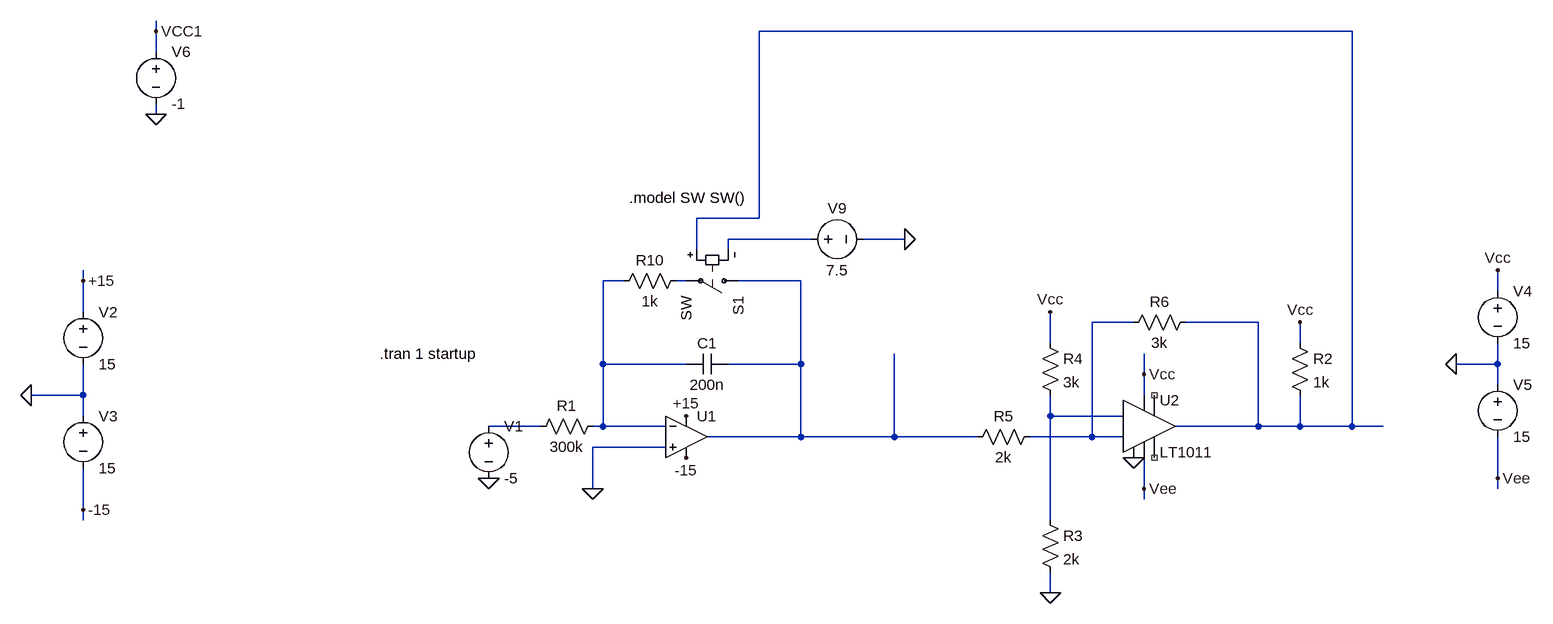
[diagram p0: schematic Simu_final.asc]
Simu_final.asc, the LTspice schematic file:
Version 4
SHEET 1 880 680
WIRE -2704 -432 -2704 -448
WIRE -864 -432 -1776 -432
WIRE -2704 -400 -2704 -432
WIRE -2704 -304 -2704 -320
WIRE -1776 -144 -1776 -432
WIRE -1776 -144 -1872 -144
WIRE -1696 -112 -1824 -112
WIRE -1552 -112 -1616 -112
WIRE -1872 -96 -1872 -144
WIRE -1824 -96 -1824 -112
WIRE -2816 -48 -2816 -64
WIRE -1984 -48 -2016 -48
WIRE -1888 -48 -1904 -48
WIRE -1712 -48 -1808 -48
WIRE -640 -32 -640 -64
WIRE -2816 0 -2816 -48
WIRE -1200 16 -1264 16
WIRE -1008 16 -1120 16
WIRE -1328 48 -1328 0
WIRE -944 48 -944 16
WIRE -2016 80 -2016 -48
WIRE -1888 80 -2016 80
WIRE -1712 80 -1712 -48
WIRE -1712 80 -1824 80
WIRE -640 80 -640 48
WIRE -640 80 -704 80
WIRE -1184 96 -1184 64
WIRE -640 112 -640 80
WIRE -2816 128 -2816 80
WIRE -2816 128 -2896 128
WIRE -1184 128 -1184 96
WIRE -2816 160 -2816 128
WIRE -1328 160 -1328 128
WIRE -1216 160 -1328 160
WIRE -2112 176 -2192 176
WIRE -2016 176 -2016 80
WIRE -2016 176 -2032 176
WIRE -1920 176 -2016 176
WIRE -1008 176 -1008 16
WIRE -1008 176 -1136 176
WIRE -944 176 -944 128
WIRE -944 176 -1008 176
WIRE -864 176 -864 -432
WIRE -864 176 -944 176
WIRE -816 176 -864 176
WIRE -1712 192 -1712 80
WIRE -1712 192 -1856 192
WIRE -1568 192 -1568 64
WIRE -1568 192 -1712 192
WIRE -1440 192 -1568 192
WIRE -1264 192 -1264 16
WIRE -1264 192 -1360 192
WIRE -1216 192 -1264 192
WIRE -1920 208 -2032 208
WIRE -640 256 -640 192
WIRE -2032 272 -2032 208
WIRE -1184 272 -1184 224
WIRE -640 272 -640 256
WIRE -1184 288 -1184 272
WIRE -2816 304 -2816 240
WIRE -2816 320 -2816 304
WIRE -1328 320 -1328 160
WIRE -1328 432 -1328 400
FLAG -2032 272 0
FLAG -2896 128 0
FLAG -2816 -48 +15
FLAG -1888 160 +15
FLAG -1888 224 -15
FLAG -2192 256 0
FLAG -2816 304 -15
FLAG -1328 432 0
FLAG -1200 224 0
FLAG -704 80 0
FLAG -640 -64 Vcc
FLAG -1184 96 Vcc
FLAG -640 256 Vee
FLAG -1184 272 Vee
FLAG -944 16 Vcc
FLAG -1328 0 Vcc
FLAG -2704 -304 0
FLAG -2704 -432 VCC1
FLAG -1552 -112 0
SYMBOL UniversalOpamp2 -1888 192 R0
SYMATTR InstName U1
SYMBOL res -2016 160 R90
WINDOW 0 0 56 VBottom 2
WINDOW 3 32 56 VTop 2
SYMATTR InstName R1
SYMATTR Value 300k
SYMBOL cap -1824 64 R90
WINDOW 0 0 32 VBottom 2
WINDOW 3 32 32 VTop 2
SYMATTR InstName C1
SYMATTR Value 200n
SYMBOL voltage -2816 -16 R0
WINDOW 123 0 0 Left 2
WINDOW 39 0 0 Left 2
SYMATTR InstName V2
SYMATTR Value 15
SYMBOL voltage -2816 144 R0
WINDOW 123 0 0 Left 2
WINDOW 39 0 0 Left 2
SYMATTR InstName V3
SYMATTR Value 15
SYMBOL voltage -2192 160 R0
WINDOW 123 0 0 Left 2
WINDOW 39 0 0 Left 2
SYMATTR InstName V1
SYMATTR Value -5
SYMBOL LT1011 -1184 176 R0
SYMATTR InstName U2
SYMBOL res -960 32 R0
SYMATTR InstName R2
SYMATTR Value 1k
SYMBOL res -1344 304 R0
SYMATTR InstName R3
SYMATTR Value 2k
SYMBOL res -1344 32 R0
SYMATTR InstName R4
SYMATTR Value 3k
SYMBOL voltage -640 -48 R0
WINDOW 123 0 0 Left 2
WINDOW 39 0 0 Left 2
SYMATTR InstName V4
SYMATTR Value 15
SYMBOL voltage -640 96 R0
WINDOW 123 0 0 Left 2
WINDOW 39 0 0 Left 2
SYMATTR InstName V5
SYMATTR Value 15
SYMBOL res -1344 176 R90
WINDOW 0 0 56 VBottom 2
WINDOW 3 32 56 VTop 2
SYMATTR InstName R5
SYMATTR Value 2k
SYMBOL res -1104 0 R90
WINDOW 0 0 56 VBottom 2
WINDOW 3 32 56 VTop 2
SYMATTR InstName R6
SYMATTR Value 3k
SYMBOL voltage -2704 -416 R0
WINDOW 123 0 0 Left 2
WINDOW 39 0 0 Left 2
SYMATTR InstName V6
SYMATTR Value -1
SYMBOL sw -1792 -48 R90
SYMATTR InstName S1
SYMBOL res -1888 -64 R90
WINDOW 0 0 56 VBottom 2
WINDOW 3 32 56 VTop 2
SYMATTR InstName R10
SYMATTR Value 1k
SYMBOL voltage -1712 -112 R270
WINDOW 0 32 56 VTop 2
WINDOW 3 -32 56 VBottom 2
SYMATTR InstName V9
SYMATTR Value 7.5
TEXT -2360 64 Left 2 !.tran 1 startup
TEXT -1976 -176 Left 2 !.model SW SW()

The netlist it stands for:
* Simu_final.asc
XU1 0 N003 +15 -15 N005 level.2 Avol=1Meg GBW=10Meg Slew=10Meg ilimit=25m rail=0 Vos=0 phimargin=45 en=0 enk=0 in=0 ink=0 Rin=500Meg  ; pins IN+ IN- V+ V- OUT
R1 N003 N008 300k
C1 N005 N003 200n
V2 +15 0 15
V3 0 -15 15
V1 N008 0 -5
XU2 0 N006 N007 Vee NC_01 NC_02 N001 Vcc LT1011
R2 Vcc N001 1k
R3 N007 0 2k
R4 Vcc N007 3k
V4 Vcc 0 15
V5 0 Vee 15
R5 N006 N005 2k
R6 N001 N006 3k
V6 VCC1 0 -1
S1 N005 N004 N001 N002 SW
R10 N004 N003 1k
V9 N002 0 7.5
.tran 1 startup
.model SW SW()
.lib UniversalOpamps2.sub
.lib LTC1.lib
.backanno
.end